# EAGLE design SC70-5 (EAGLE 7.3.0)
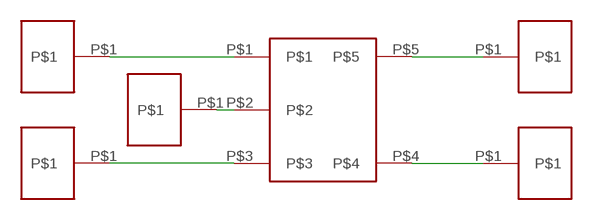
[diagram p0: schematic, sheet 1]

## Parts
U$1  SC70-5SC70-5  [SC70-5]
U$2  PAD100MIL  [100MIL_PAD]
U$3  PAD100MIL  [100MIL_PAD]
U$4  PAD100MIL  [100MIL_PAD]
U$5  PAD100MIL  [100MIL_PAD]
U$6  PAD100MIL  [100MIL_PAD]

## Nets
N$1: U$1.P$1 U$2.P$1
N$2: U$1.P$2 U$3.P$1
N$3: U$1.P$3 U$4.P$1
N$4: U$1.P$5 U$6.P$1
N$5: U$1.P$4 U$5.P$1

## Library data of the parts
U$1 = generic_smd:SC70-5
U$2-U$6 = generic_smd:PAD

## Board
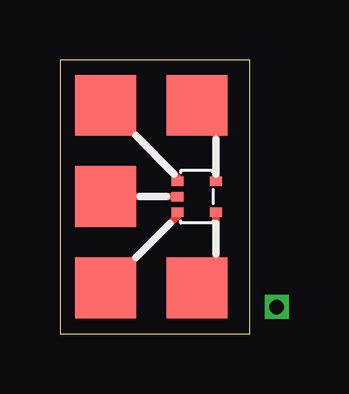
[diagram p1: board, top side]
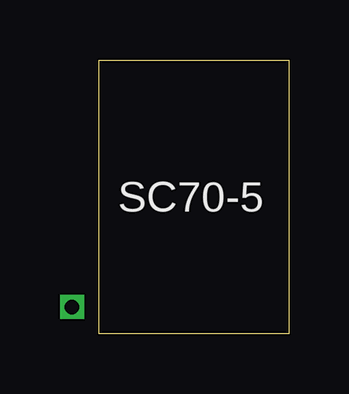
[diagram p2: board, bottom side, seen from below]

Size 7.92 x 11.42 mm. Coordinates in mm from the lower left corner, seen from the top.
Outline: 0,0 7.92,0 7.92,11.42 0,11.42 0,0
Copper layers (1*16): Top 0.035mm / dielectric 1.5mm / Bottom 0.035mm
Design rules "default": minimum track width 10mil, minimum drill 24mil, track to track 8mil, track to pad 8mil, pad to pad 8mil, via to via 8mil, smd to smd 8mil, copper to edge 40mil, drill to drill 8mil, minimum pad ring 10mil, minimum via ring 8mil, stop-mask expansion 4mil, vias tented up to drill 0mil, thermal gap 10mil

### Footprints (pad centres in the part's own frame; a part is rotated, then mirrored left to right if it is on the bottom)
SC70-5 = smd 0.4 x 0.5: P$1 -0.65,-0.8; P$2 0,-0.8; P$3 0.65,-0.8; P$4 0.65,0.8; P$5 -0.65,0.8
100MIL_PAD = smd 2.54 x 2.54: P$1 0,0

### Placement (x,y rotation side)
U$1  5.71,5.71 270 top
U$2  1.91,9.53 0 top
U$3  1.91,5.71 0 top
U$4  1.91,1.91 0 top
U$5  5.71,1.91 0 top
U$6  5.71,9.53 0 top

### Tracks (layer width: path | path; a pad name or v marks a point on that pad's centre or on a via)
N$1
  Top 0.305: U$1.P$1 4.92,6.51 U$2.P$1
N$2
  Top 0.305: U$1.P$2 U$3.P$1
N$3
  Top 0.305: U$1.P$3 4.92,4.92 U$4.P$1
N$4
  Top 0.305: U$1.P$5 6.51,8.72 U$6.P$1
N$5
  Top 0.305: U$1.P$4 6.51,2.07 6.35,1.91 U$5.P$1
N$6  (via drill 0.6)
  other vias: 9.05,1.11

### Text on the board
bPlace: SC70-5
Document: via required to force drill file generation